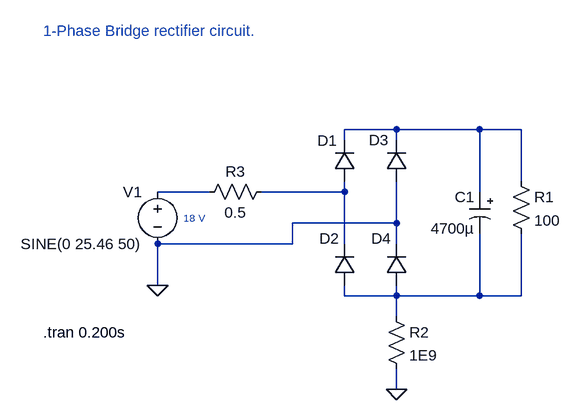
[diagram p0: schematic rectifyer.asc]
rectifyer.asc, the LTspice schematic file:
Version 4
SHEET 1 932 680
WIRE 416 48 336 48
WIRE 544 48 416 48
WIRE 608 48 544 48
WIRE 336 64 336 48
WIRE 416 64 416 48
WIRE 608 128 608 48
WIRE 128 144 48 144
WIRE 336 144 336 128
WIRE 336 144 208 144
WIRE 544 144 544 48
WIRE 416 192 416 128
WIRE 416 192 256 192
WIRE 256 224 256 192
WIRE 256 224 48 224
WIRE 336 224 336 144
WIRE 416 224 416 192
WIRE 48 288 48 224
WIRE 336 304 336 288
WIRE 416 304 416 288
WIRE 416 304 336 304
WIRE 544 304 544 208
WIRE 544 304 416 304
WIRE 608 304 608 208
WIRE 608 304 544 304
WIRE 416 336 416 304
WIRE 416 448 416 416
FLAG 48 288 0
FLAG 416 448 0
SYMBOL diode 352 128 R180
WINDOW 0 27 63 Left 2
WINDOW 3 24 0 Invisible 2
SYMATTR InstName D1
SYMATTR Value MURS320
SYMBOL diode 352 288 R180
WINDOW 0 24 72 Left 2
WINDOW 3 24 0 Invisible 2
SYMATTR InstName D2
SYMATTR Value MURS320
SYMBOL diode 432 128 R180
WINDOW 0 28 64 Left 2
WINDOW 3 24 0 Invisible 2
SYMATTR InstName D3
SYMATTR Value MURS320
SYMBOL diode 432 288 R180
WINDOW 0 24 72 Left 2
WINDOW 3 24 0 Invisible 2
SYMATTR InstName D4
SYMATTR Value MURS320
SYMBOL voltage 48 128 M0
WINDOW 123 0 0 Left 2
WINDOW 39 0 0 Left 2
SYMATTR InstName V1
SYMATTR Value SINE(0 25.46 50)
SYMBOL polcap 560 144 M0
WINDOW 3 24 56 Left 2
SYMATTR Value 4700µ
SYMATTR InstName C1
SYMATTR Description Capacitor
SYMATTR Type cap
SYMATTR SpiceLine V=16 Irms=2.17 Rser=0.035 Lser=0
SYMBOL res 592 112 R0
SYMATTR InstName R1
SYMATTR Value 100
SYMBOL res 112 160 R270
WINDOW 0 32 56 VTop 2
WINDOW 3 0 56 VBottom 2
SYMATTR InstName R3
SYMATTR Value 0.5
SYMBOL res 400 320 R0
SYMATTR InstName R2
SYMATTR Value 1E9
TEXT -128 360 Left 2 !.tran 0.200s
TEXT -128 -104 Left 2 ;1-Phase Bridge rectifier circuit.
TEXT 88 184 Left 1 ;18 V

The netlist it stands for:
* rectifyer.asc
D1 N003 N001 MURS320
D2 N004 N003 MURS320
D3 0 N001 MURS320
D4 N004 0 MURS320
V1 N002 0 SINE(0 25.46 50)
C1 N001 N004 4700µ V=16 Irms=2.17 Rser=0.035 Lser=0
R1 N001 N004 100
R3 N002 N003 0.5
R2 N004 0 1E9
.model D D
.lib standard.dio
.tran 0.200s
* 1-Phase Bridge rectifier circuit.
* 18 V
.backanno
.end